# EAGLE design OmniCar_v0.1 (EAGLE 8.2.0)
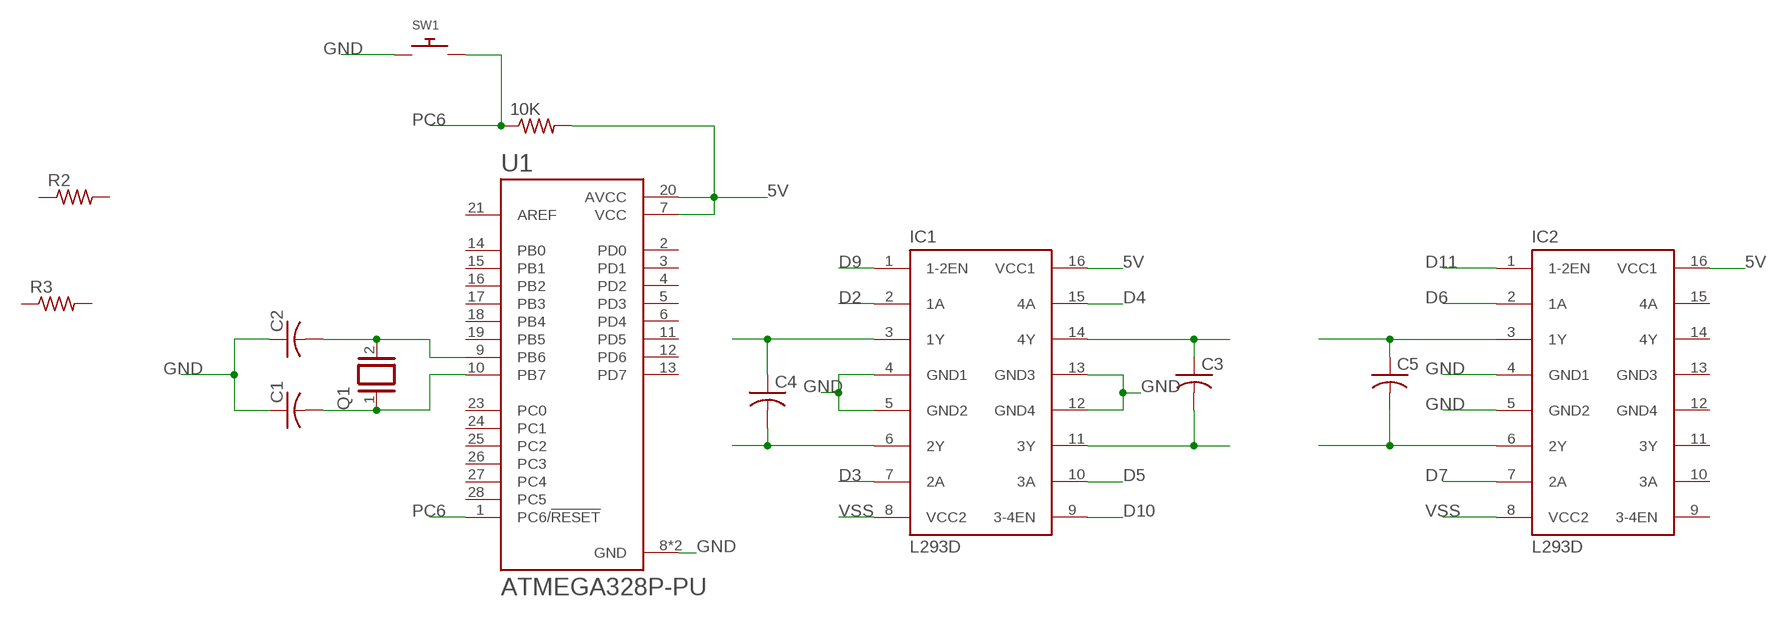
[diagram p0: schematic, sheet 1]

## Parts
10K  R-US_0204/5  [0204/5]
C1  C-US025-030X050  [C025-030X050]
C2  C-US025-030X050  [C025-030X050]
C3  C-US025-030X050  [C025-030X050]
C4  C-US025-030X050  [C025-030X050]
C5  C-US025-030X050  [C025-030X050]
IC1  L293D  [DIL16]
IC2  L293D  [DIL16]
Q1  XTAL  [Q]
R2  R-US_0204/5  [0204/5]
R3  R-US_0204/5  [0204/5]
SW1  SWITCH_PUSHBUTTONEVQ-PE  [TACT_PANA-EVQ]
U1  ATMEGA328P-PU  [DIP794W46P254L2967H457Q28B]

## Nets
5V: 10K.2 IC1.16(VCC1) IC2.16(VCC1) U1.7(VCC) U1.20(AVCC)
D2: IC1.2(1A)
D3: IC1.7(2A)
D4: IC1.15(4A)
D5: IC1.10(3A)
D6: IC2.2(1A)
D7: IC2.7(2A)
D9: IC1.1(1-2EN)
D10: IC1.9(3-4EN)
D11: IC2.1(1-2EN)
GND: C1.1 C2.1 IC1.4(GND1) IC1.5(GND2) IC1.12(GND4) IC1.13(GND3) IC2.4(GND1) IC2.5(GND2) SW1.P$1 U1.8(GND) U1.22(GND)
N$1: C2.2 Q1.2 U1.9(PB6)
N$2: C1.2 Q1.1 U1.10(PB7)
N$3: C4.1 IC1.3(1Y)
N$4: C4.2 IC1.6(2Y)
N$5: C3.1 IC1.14(4Y)
N$6: C3.2 IC1.11(3Y)
N$8: C5.1 IC2.3(1Y)
N$9: C5.2 IC2.6(2Y)
PC6: 10K.1 SW1.P$2 U1.1(PC6/!RESET)
VSS: IC1.8(VCC2) IC2.8(VCC2)
Unconnected: IC2.9(3-4EN) IC2.10(3A) IC2.11(3Y) IC2.14(4Y) IC2.15(4A) R2.1 R2.2 R3.1 R3.2 U1.2(PD0) U1.3(PD1) U1.4(PD2) U1.5(PD3) U1.6(PD4) U1.11(PD5) U1.12(PD6) U1.13(PD7) U1.14(PB0) U1.15(PB1) U1.16(PB2) U1.17(PB3) U1.18(PB4) U1.19(PB5) U1.21(AREF) U1.23(PC0) U1.24(PC1) U1.25(PC2) U1.26(PC3) U1.27(PC4) U1.28(PC5)

## Power pins joined to a net without a drawn wire
GND3: IC2.13(GND3)
GND4: IC2.12(GND4)

## Library data of the parts
10K R2 R3 = adafruit:R-US_: RESISTOR, American symbol
C1-C5 = adafruit:C-US: CAPACITOR, American symbol
IC1 IC2 = L293D:L293D: PUSH-PULL 4 CHANNEL DRIVER; AVAILABILITY: Good; DESCRIPTION: Driver; 36V; Power DIP; 600mA Low LevelO/P; 1.2A O/P High Level; 4 Drivers; 7V; MF: STMicroelectronics; MP: L293D; PACKAGE: SOIC-20 STMicroelectronics; PRICE: 2.43 USD
Q1 = special:XTAL: CRYSTAL
SW1 = adafruit:SWITCH_PUSHBUTTON: Buttons SOFTTOUCHSMD_SJ - Soft touch temporary push button (Super Junk Akihabara) Compatible with SKPMANE010 [Mouser: 688-SKPMAN] C&K_KSS = Digikey: KSS221GLFS
U1 = ATMEGA328P-PU:ATMEGA328P-PU: ATmega Series 20 MHz 32 KB Flash 2 KB SRAM 8-Bit Microcontroller - DIP-28; AVAILABILITY: Good; DESCRIPTION: Embedded microcontroller ATMEGA328P-PU PDIP 28 Microchip Technology 8-Bit 20 MHz I/O number 23; MF: Microchip; MP: ATMEGA328P-PU; PACKAGE: PDIP-28 Microchip; PRICE: 2.18 USD

## Board
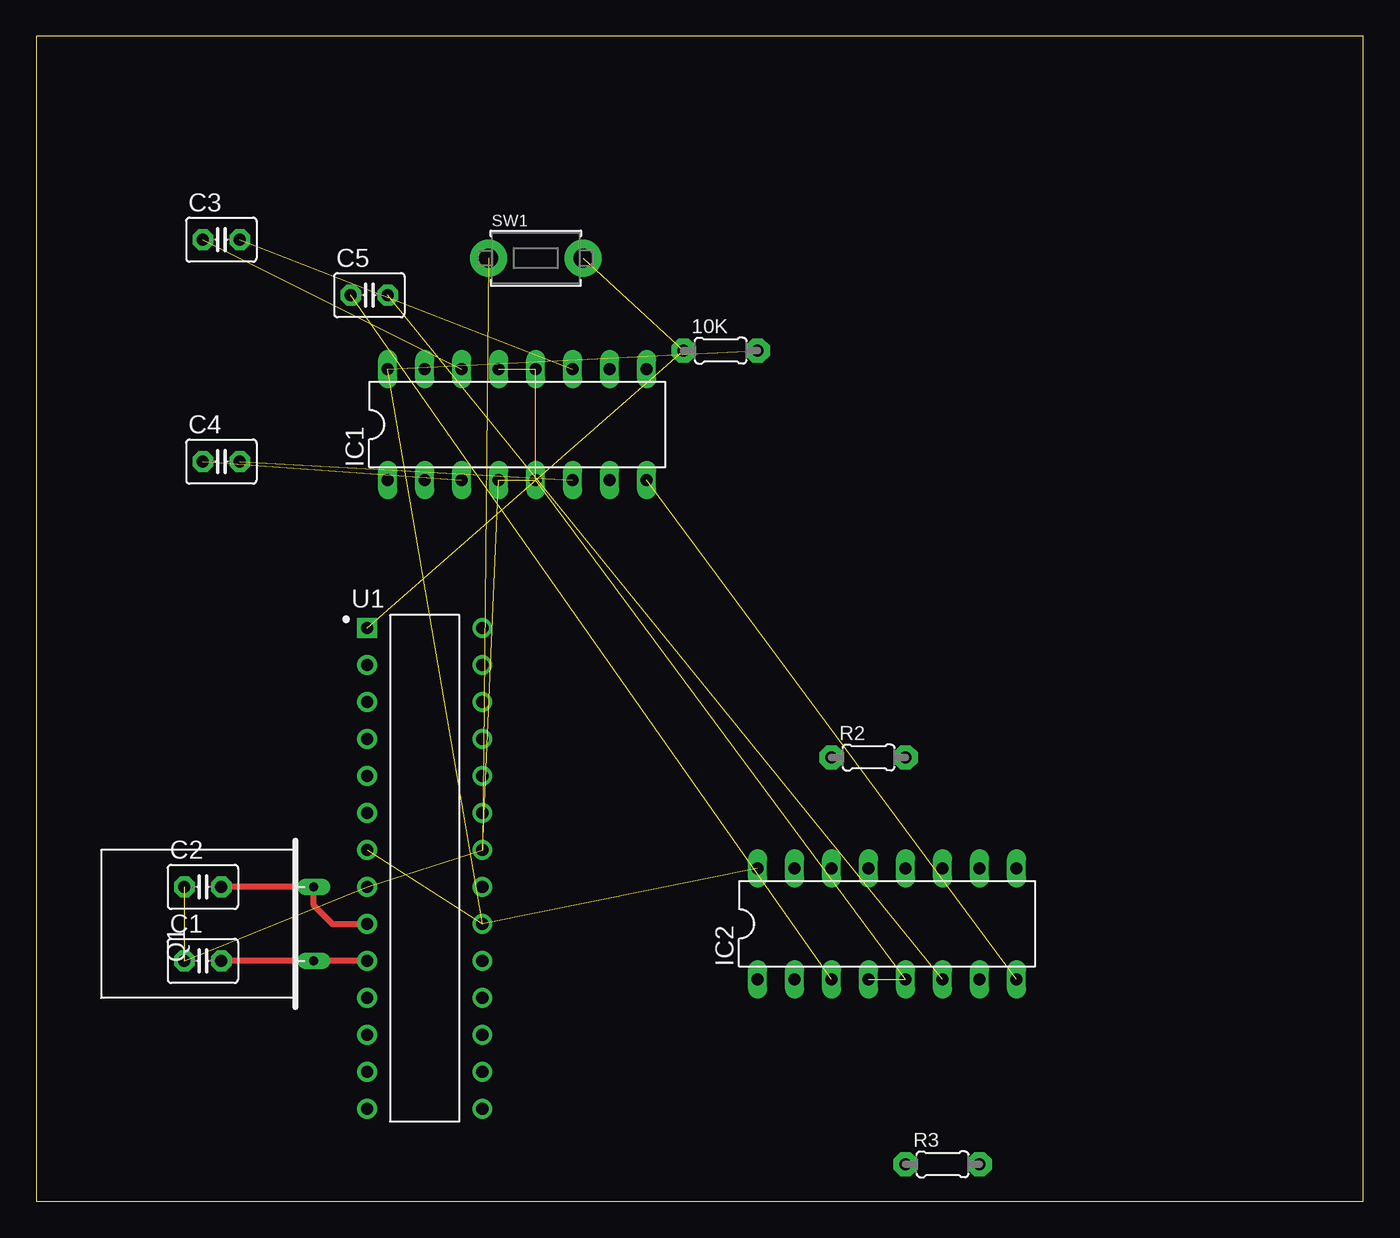
[diagram p1: board, top side]

Size 91.11 x 80 mm. Coordinates in mm from the lower left corner, seen from the top.
Outline: 0,0 91.11,0 91.11,80 0,80 0,0
Copper layers (1*16): Top 0.035mm / dielectric 1.5mm / Bottom 0.035mm
Design rules "default": minimum track width 6mil, minimum drill 0.35mm, track to track 6mil, track to pad 6mil, pad to pad 6mil, via to via 6mil, smd to smd 6mil, copper to edge 40mil, drill to drill 6mil, minimum pad ring 10mil, minimum via ring 8mil, stop-mask expansion 4mil, vias tented up to drill 0mil, thermal gap 10mil

### Footprints (pad centres in the part's own frame; a part is rotated, then mirrored left to right if it is on the bottom)
0204/5 = drill 0.813 pad 1.676 octagon: 1 -2.54,0; 2 2.54,0
C025-030X050 = drill 0.813 pad 1.422 octagon: 1 -1.27,0; 2 1.27,0
DIL16 = drill 0.813 long: 1 -8.89,-3.81; 2 -6.35,-3.81; 3 -3.81,-3.81; 4 -1.27,-3.81; 5 1.27,-3.81; 6 3.81,-3.81; 7 6.35,-3.81; 8 8.89,-3.81; 9 8.89,3.81; 10 6.35,3.81; 11 3.81,3.81; 12 1.27,3.81; 13 -1.27,3.81; 14 -3.81,3.81; 15 -6.35,3.81; 16 -8.89,3.81
Q = drill 0.61 long: 1 -2.54,-7.62; 2 2.54,-7.62
TACT_PANA-EVQ = drill 1.3 pad 2.54: P$1 -3.25,0; P$2 3.25,0
DIP794W46P254L2967H457Q28B = drill 0.85 square: 1 -3.96,16.51 | drill 0.85: 2 -3.96,13.97; 3 -3.96,11.43; 4 -3.96,8.89; 5 -3.96,6.35; 6 -3.96,3.81; 7 -3.96,1.27; 8 -3.96,-1.27; 9 -3.96,-3.81; 10 -3.96,-6.35; 11 -3.96,-8.89; 12 -3.96,-11.43; 13 -3.96,-13.97; 14 -3.96,-16.51; 15 3.96,-16.51; 16 3.96,-13.97; 17 3.96,-11.43; 18 3.96,-8.89; 19 3.96,-6.35; 20 3.96,-3.81; 21 3.96,-1.27; 22 3.96,1.27; 23 3.96,3.81; 24 3.96,6.35; 25 3.96,8.89; 26 3.96,11.43; 27 3.96,13.97; 28 3.96,16.51

### Placement (x,y rotation side)
10K  46.99,58.42 0 top
C1  11.43,16.51 0 top
C2  11.43,21.59 0 top
C3  12.7,66.04 0 top
C4  12.7,50.8 0 top
C5  22.86,62.23 0 top
IC1  33.02,53.34 0 top
IC2  58.42,19.05 0 top
Q1  11.43,19.05 90 top
R2  57.15,30.48 0 top
R3  62.23,2.54 0 top
SW1  34.29,64.77 0 top
U1  26.67,22.86 0 top

### Tracks (layer width: path | path; a pad name or v marks a point on that pad's centre or on a via)
5V  (4 unrouted)
GND  (10 unrouted)
N$1
  Top 0.406: U1.9 20.32,19.05 19.05,20.32 Q1.2 C2.2
N$2
  Top 0.406: U1.10 Q1.1 C1.2
N$3  (1 unrouted)
N$4  (1 unrouted)
N$5  (1 unrouted)
N$6  (1 unrouted)
N$8  (1 unrouted)
N$9  (1 unrouted)
PC6  (2 unrouted)
VSS  (1 unrouted)